# Altium schematic sheet Line  Reader and IR Sensor.SchDoc
size A
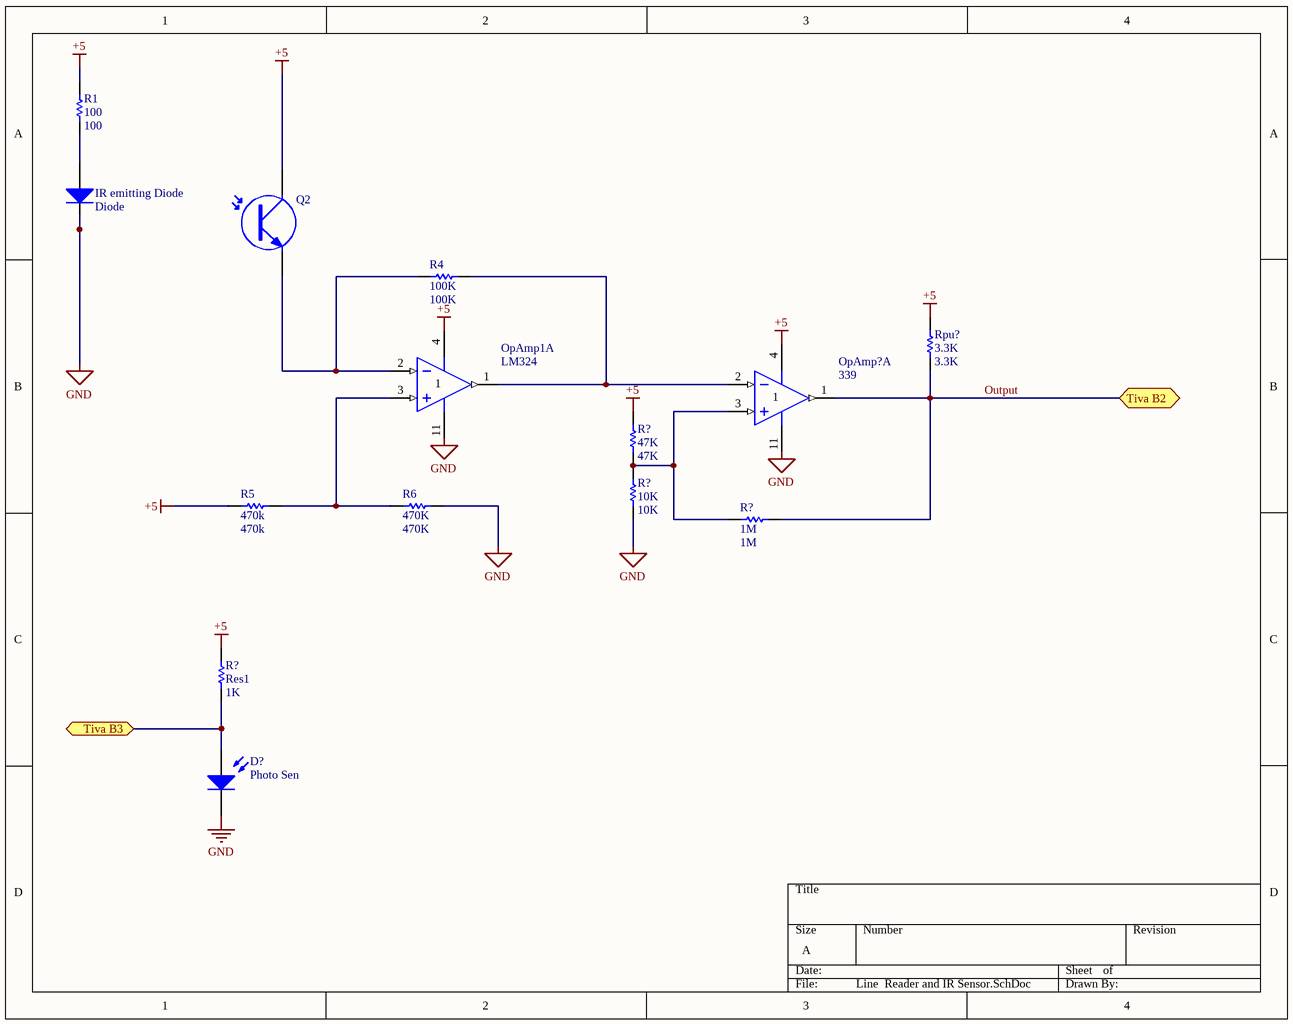
[diagram p0: Line  Reader and IR Sensor.SchDoc]

## Parts
(Parts that share a designator on the sheet are numbered #1, #2 ... from top to bottom, then left to right.)
D?  Photo Sen  [PIN2]
IR_emitting_Diode  Diode  [DSO-C2/X3.3]
OpAmp1  LM324  [DIP-14]  (part A of 4)
OpAmp?  339  [DIP-14]  (part A of 4)
Q2  LTR 3208  [SFM-T2(3)/X1.6V]  (value not drawn)
R1  100  [AXIAL-0.3]
R4  100K  [AXIAL-0.3]
R5  470k  [AXIAL-0.3]
R6  470K  [AXIAL-0.3]
R?#1  47K  [AXIAL-0.3]
R?#2  10K  [AXIAL-0.3]
R?#3  1M  [AXIAL-0.3]
R?#4  Res1  value 1K  [AXIAL-0.3]
Rpu?  3.3K  [AXIAL-0.3]

## Ports
Tiva B2, Tiva B3

## Nets
+5: OpAmp1.4(V+) OpAmp?.4(V+) Q2.1(C) R1.2 R5.1 R?#1.2 R?#4.2 Rpu?.2
GND: D?.2(K) IR_emitting_Diode.2(K) OpAmp1.11(GND) OpAmp?.11(GND) R6.2 R?#2.1
Output: OpAmp?.1(OUT) R?#3.1 Rpu?.1 ; port Tiva B2
Tiva B3: D?.1(A) R?#4.1 ; port Tiva B3
NetIR_emitting_Diode_1: IR_emitting_Diode.1(A) R1.1
NetOpAmp1_1: OpAmp1.1(OUT) OpAmp?.2(IN-) R4.2
NetOpAmp1_2: OpAmp1.2(IN-) Q2.3(E) R4.1
NetOpAmp1_3: OpAmp1.3(IN+) R5.2 R6.1
NetOpAmp?_3: OpAmp?.3(IN+) R?#1.1 R?#2.2 R?#3.2

## Library data of the parts
D? = Photo Sen: Photosensitive Diode; Manufacturer: Generic Components; Class: Optoelectronic; Published: 1999
IR_emitting_Diode = Diode: Default Diode; Manufacturer: Generic Components; Class: Discrete; SubClass: Diode - Switching; Published: 08/06/2000; Publisher: Altium Hobart Technology Centre
OpAmp1 OpAmp? = LM324AJ: Low-Power Quad Operational Amplifier; Manufacturer: National Semiconductor; Published: 15/04/2002; Publisher: Altium Hobart Technology Centre; Class: Amplifier; SubClass: Operational Amplifier
Q2 = Photo NPN: NPN Phototransistor; Manufacturer: Generic Components; Class: Optoelectronic; Published: 1999; Name: LTR 3208
R1 R4-R6 R?#1-R?#4 Rpu? = Res1: Resistor; Manufacturer: Generic Components; Class: Passive; Published: 08/06/2000; Publisher: Altium Hobart Technology Centre; SubClass: Resistor
  R1: Value: 100
  R4: Value: 100K
  R5: Value: 470k
  R6: Value: 470K
  R?#1: Value: 47K
  R?#2: Value: 10K
  R?#3: Value: 1M
  Rpu?: Value: 3.3K